# EAGLE design EMG_SENSOR (EAGLE 9.2.2)
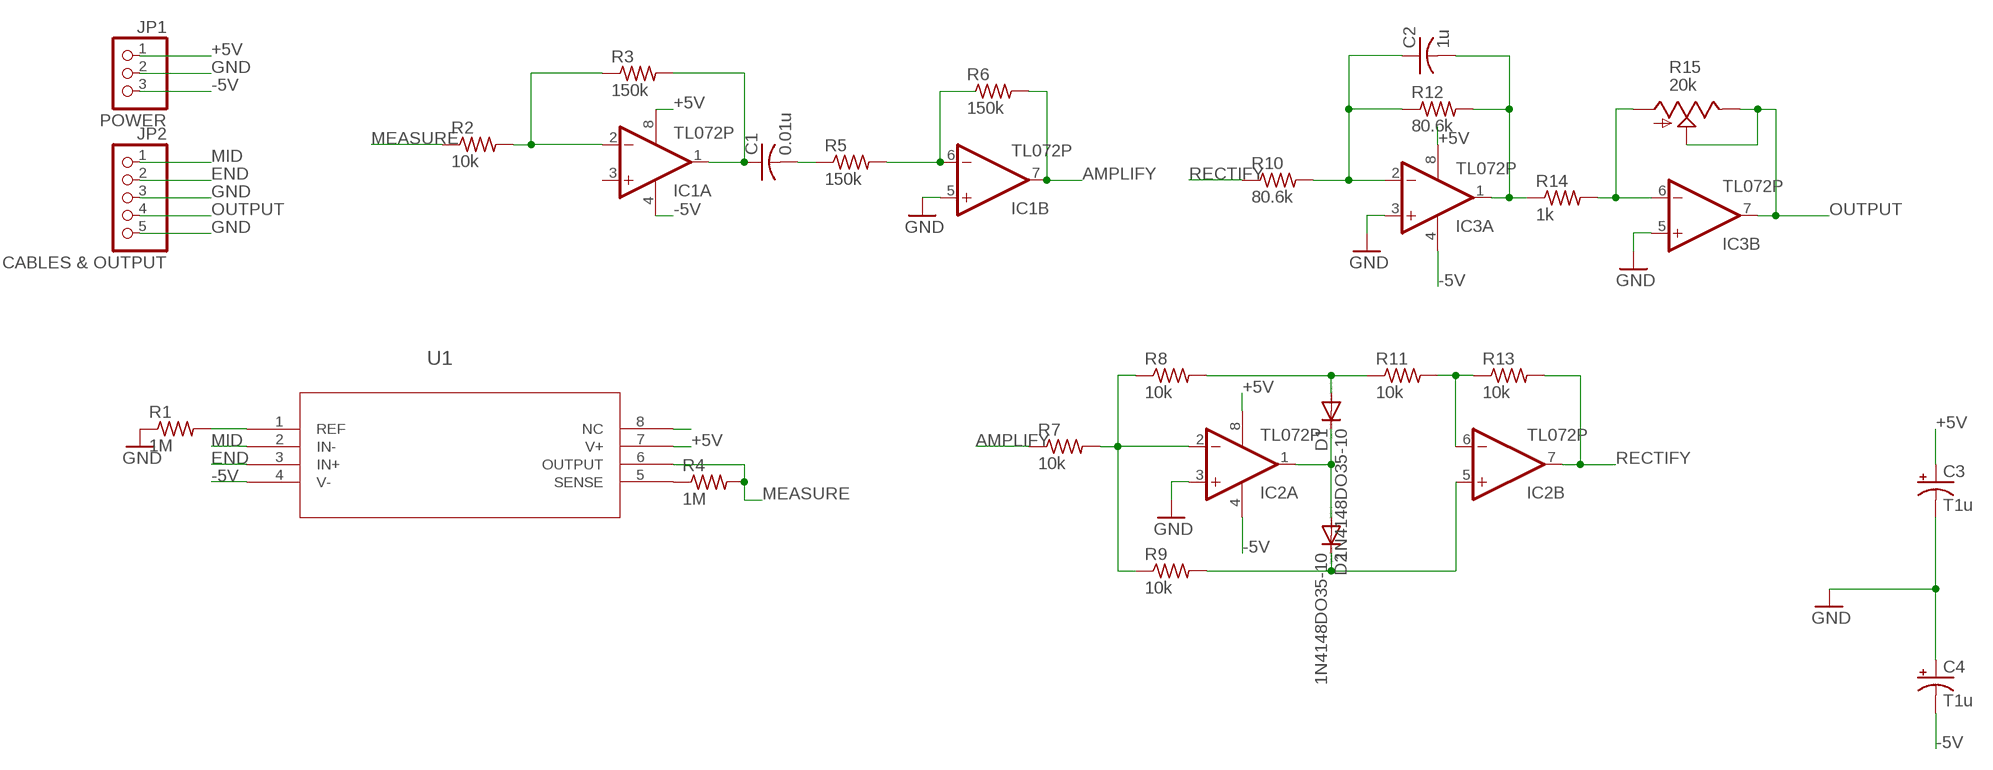
[diagram p0: schematic, sheet 1]

## Parts
C1  0.01u  C-USC1206K  [C1206K]
C2  1u  C-USC1206K  [C1206K]
C3  T1u  CPOL-USE2-4  [E2-4]
C4  T1u  CPOL-USE2-4  [E2-4]
D1  1N4148DO35-10  [DO35-10]
D2  1N4148DO35-10  [DO35-10]
IC1  TL072P  [DIL08]
IC2  TL072P  [DIL08]
IC3  TL072P  [DIL08]
JP1  POWER  PINHD-1X3  [1X03]
JP2  CABLES & OUTPUT  PINHD-1X5  [1X05]
R1  1M  R-US_R1206W  [R1206W]
R2  10k  R-US_R1206W  [R1206W]
R3  150k  R-US_R1206W  [R1206W]
R4  1M  R-US_R1206W  [R1206W]
R5  150k  R-US_R1206W  [R1206W]
R6  150k  R-US_R1206W  [R1206W]
R7  10k  R-US_R1206W  [R1206W]
R8  10k  R-US_R1206W  [R1206W]
R9  10k  R-US_R1206W  [R1206W]
R10  80.6k  R-US_R1206W  [R1206W]
R11  10k  R-US_R1206W  [R1206W]
R12  80.6k  R-US_R1206W  [R1206W]
R13  10k  R-US_R1206W  [R1206W]
R14  1k  R-US_R1206W  [R1206W]
R15  20k  TRIM_US-B25P  [B25P]
U1  INA106_P_8  [P8]

## Nets
+5V: C3.+ IC1.8(P:V+) IC2.8(P:V+) IC3.8(P:V+) JP1.1 U1.7(V+)
-5V: C4.- IC1.4(P:V-) IC2.4(P:V-) IC3.4(P:V-) JP1.3 U1.4(V-)
AMPLIFY: IC1.7(B:OUT) R6.2 R7.1
END: JP2.2 U1.3(IN+)
GND: C3.- C4.+ IC1.5(B:+IN) IC2.3(A:+IN) IC3.3(A:+IN) IC3.5(B:+IN) JP1.2 JP2.3 JP2.5 R1.1
MEASURE: R2.1 R4.2 U1.6(OUTPUT)
MID: JP2.1 U1.2(IN-)
N$1: U1.1(REF)
N$2: IC2.2(A:-IN) R7.2 R9.1
N$3: IC2.6(B:-IN) R11.2 R13.1
N$4: IC1.2(A:-IN) R2.2 R3.1
N$5: U1.8(NC)
N$6: C1.1 IC1.1(A:OUT) R3.2
N$7: C1.2 R5.1
N$8: R4.1 U1.5(SENSE)
N$9: IC1.6(B:-IN) R5.2
N$10: R6.1
N$11: D1.C D2.A IC2.1(A:OUT)
N$12: D1.A R8.2 R11.1
N$13: C2.1 IC3.2(A:-IN) R10.2 R12.1
N$14: D2.C IC2.5(B:+IN) R9.2
N$15: R8.1
N$16: C2.2 IC3.1(A:OUT) R12.2 R14.1
N$17: IC3.6(B:-IN) R14.2 R15.A
OUTPUT: IC3.7(B:OUT) JP2.4 R15.E R15.S
RECTIFY: IC2.7(B:OUT) R10.1 R13.2
Unconnected: IC1.3(A:+IN) R1.2

## Library data of the parts
C1 = rcl:C-US: CAPACITOR, American symbol; OC_NEWARK: unknown
C2 = rcl:C-US: CAPACITOR, American symbol; MPN: MC0805Y104M500A2.54MM; OC_NEWARK: 46P6667
C3 C4 = rcl:CPOL-US: POLARIZED CAPACITOR, American symbol; OC_NEWARK: unknown
D1 D2 = diode:1N4148: DIODE high speed (Philips); OC_NEWARK: unknown
IC1-IC3 = linear:TL072: OP AMP; OC_NEWARK: unknown
JP1 = pinhead:PINHD-1X3: PIN HEADER; OC_NEWARK: unknown
JP2 = pinhead:PINHD-1X5: PIN HEADER; OC_NEWARK: unknown
R1-R14 = resistor:R-US_: RESISTOR, American symbol; OC_NEWARK: unknown
R15 = pot:TRIM_US-: POTENTIOMETER; OC_NEWARK: unknown
U1 = INA160:INA106_P_8; DATASHEETURL: httpwww.ti.comlitgpnINA106; FAMILY_NAME: DIFFERENCE AMPLIFIER; GENERIC_PART_NUMBER: INA106; INDUSTRY_STD_PKG_TYPE: PDIP; MANUFACTURER: Texas Instruments; MANUFACTURER_PART_NUMBER: ina106_p_8; OC_NEWARK: unknown; PACKAGE_DESIGNATOR: P; PIN_COUNT: 8; VENDOR: Texas Instruments

## Board
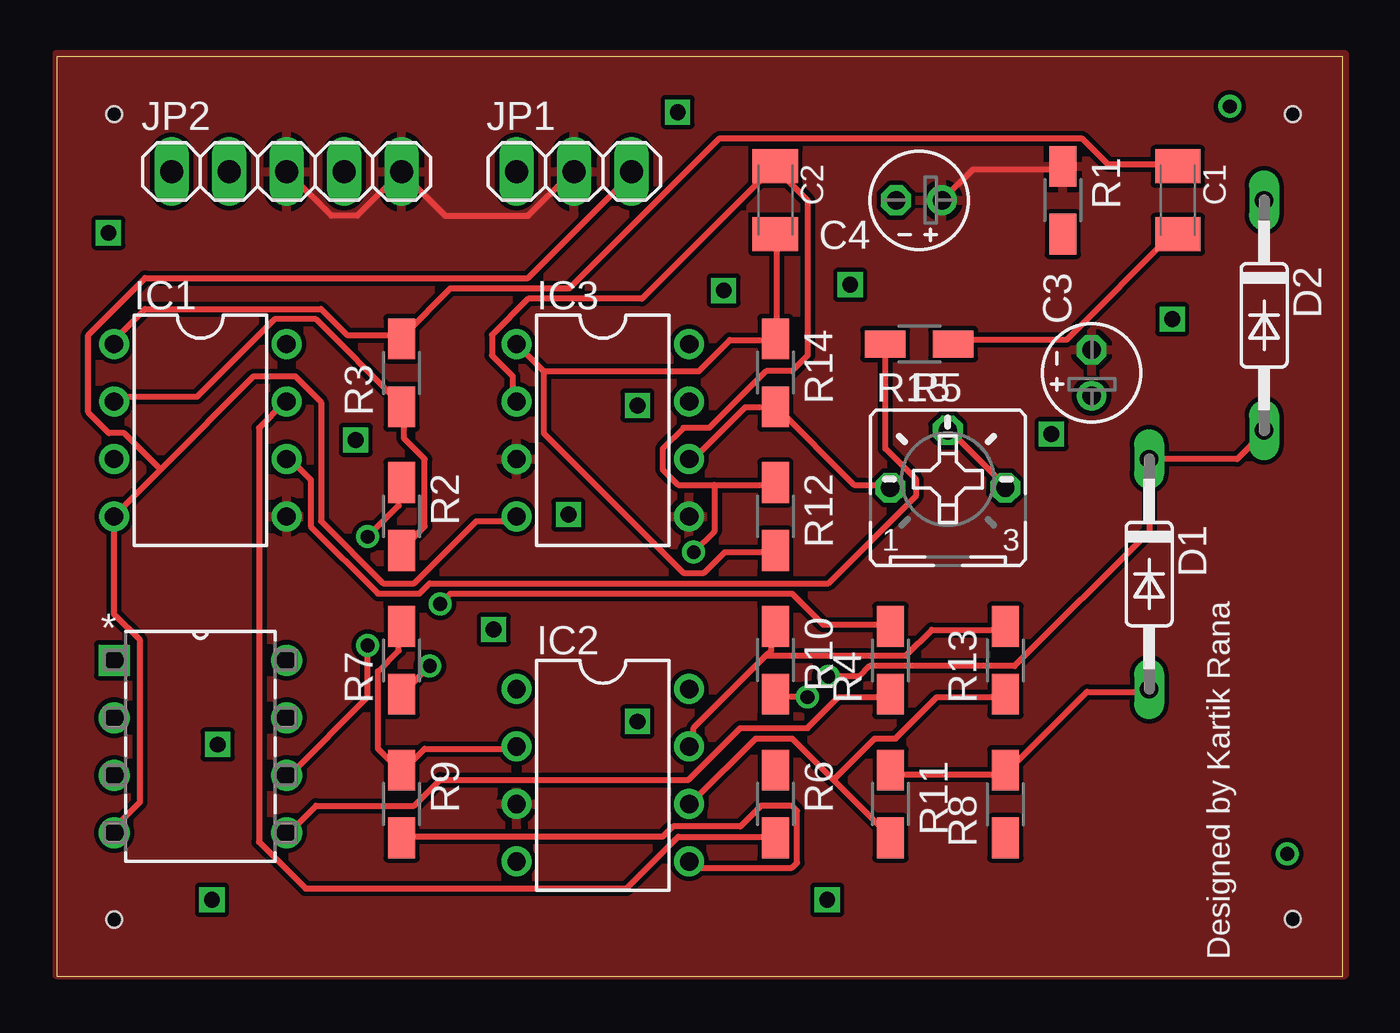
[diagram p1: board, top side]
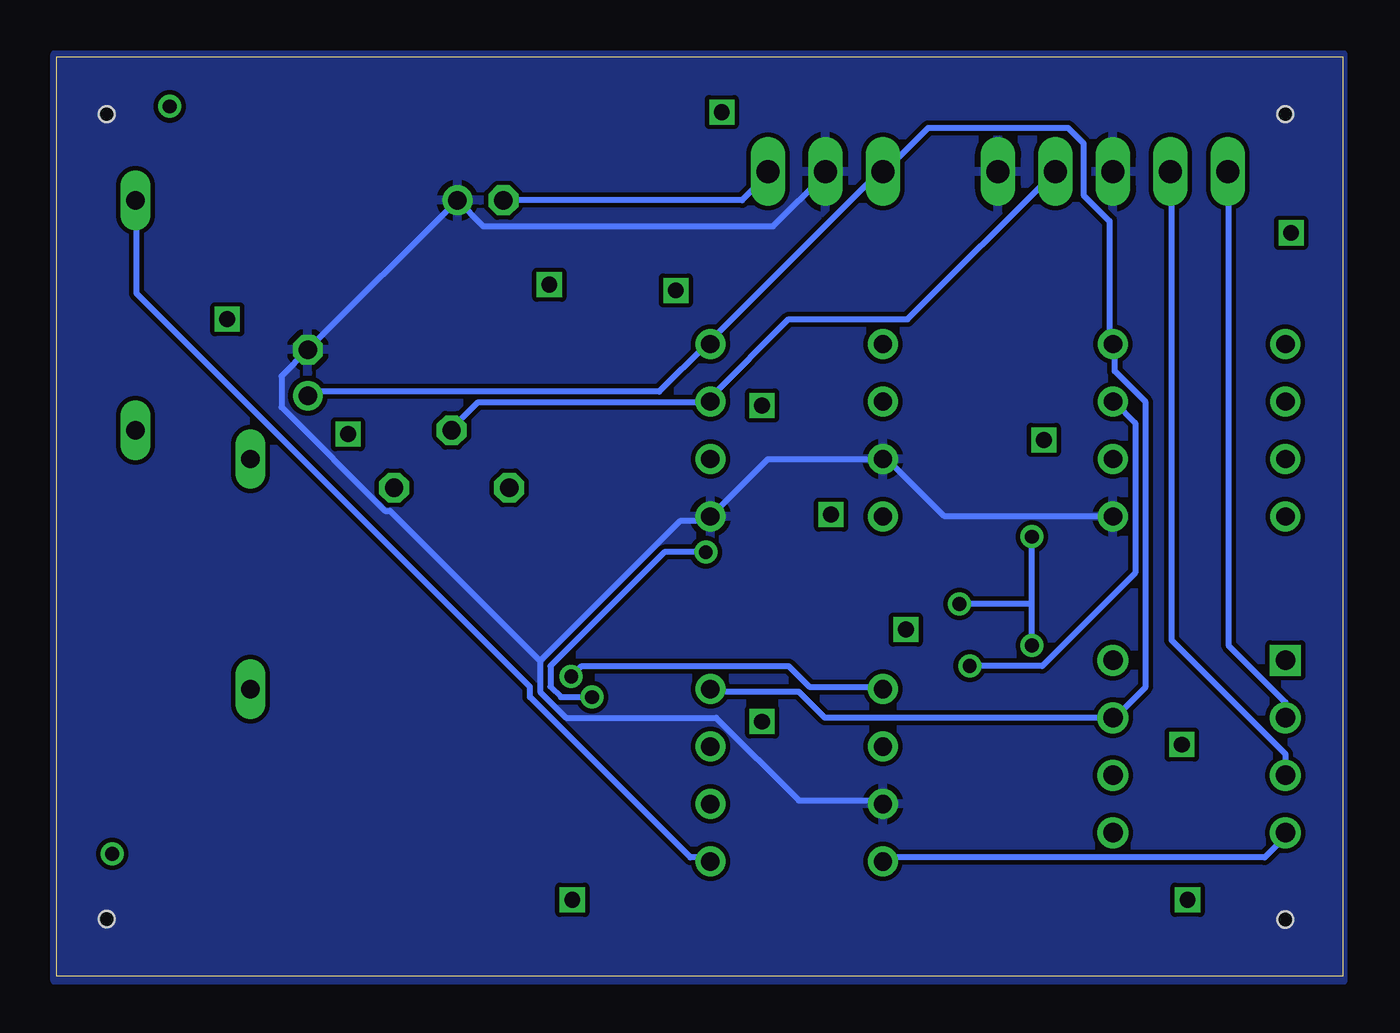
[diagram p2: board, bottom side, seen from below]

Size 56.82 x 40.62 mm. Coordinates in mm from the lower left corner, seen from the top.
Outline: 0,40.62 0,0 56.82,0 56.82,40.62 0,40.62
Copper layers (1*16): Top 0.035mm / dielectric 1.5mm / Bottom 0.035mm
Design rules "default *": minimum track width 10mil, minimum drill 24mil, track to track 8mil, track to pad 8mil, pad to pad 8mil, via to via 8mil, smd to smd 8mil, copper to edge 0mil, drill to drill 8mil, minimum pad ring 10mil, minimum via ring 8mil, stop-mask expansion 4mil, vias tented up to drill 0mil, thermal gap 10mil
Holes 0.7 mm at 54.61,38.08 54.61,2.52 2.54,38.08 2.54,2.49

### Footprints (pad centres in the part's own frame; a part is rotated, then mirrored left to right if it is on the bottom)
C1206K = smd 1.5 x 2: 1 -1.5,0; 2 1.5,0
E2-4 = drill 0.813 pad 1.27: + -1.016,0 | drill 0.813 pad 1.27 octagon: - 1.016,0
DO35-10 = drill 0.813 long: A 5.08,0; C -5.08,0
DIL08 = drill 0.813 pad 1.27: 1 -3.81,-3.81; 2 -1.27,-3.81; 3 1.27,-3.81; 4 3.81,-3.81; 5 3.81,3.81; 6 1.27,3.81; 7 -1.27,3.81; 8 -3.81,3.81
1X03 = drill 1.016 long: 1 -2.54,0; 2 0,0; 3 2.54,0
1X05 = drill 1.016 long: 1 -5.08,0; 2 -2.54,0; 3 0,0; 4 2.54,0; 5 5.08,0
R1206W = smd 1.8 x 1.2: 1 -1.499,0; 2 1.499,0
B25P = drill 0.813 octagon: A -2.54,0; E 2.54,0; S 0,2.54
P8 = drill 0.864 pad 1.372 square: 1 -7.62,7.62 | drill 0.864 pad 1.372: 2 -7.62,5.08; 3 -7.62,2.54; 4 -7.62,0; 5 0,0; 6 0,2.54; 7 0,5.08; 8 0,7.62

### Placement (x,y rotation side)
C1  49.53,34.27 270 top
C2  31.75,34.27 270 top
C3  45.72,26.65 90 top
C4  38.1,34.27 180 top
D1  48.26,17.76 270 top
D2  53.34,29.19 270 top
IC1  6.35,24.11 270 top
IC2  24.13,8.87 270 top
IC3  24.13,24.11 270 top
JP1  22.86,35.54 0 top
JP2  10.16,35.54 0 top
R1  44.45,34.27 270 top
R2  15.24,20.3 270 top
R3  15.24,26.65 90 top
R4  36.83,13.95 90 top
R5  38.1,27.92 180 top
R6  31.75,7.6 270 top
R7  15.24,13.95 90 top
R8  41.91,7.6 90 top
R9  15.24,7.6 270 top
R10  31.75,13.95 270 top
R11  36.83,7.6 270 top
R12  31.75,20.3 270 top
R13  41.91,13.95 90 top
R14  31.75,26.65 270 top
R15  39.37,21.57 0 top
U1  10.16,6.33 0 top

### Tracks (layer width: path | path; a pad name or v marks a point on that pad's centre or on a via)
+5V
  Bottom 0.254: IC2.8 27.91,12.55 24.03,12.55 22.89,11.41 U1.7 10.08,11.41 8.71,12.78 8.71,25.35 10.08,26.73 10.08,27.87 IC1.8 10.31,28.1 10.31,33.36 11.46,34.5 11.46,36.78 12.14,37.47 18.31,37.47 20.14,35.64 JP1.1 20.37,35.64 27.91,28.1 IC3.8 28.14,27.87 30.2,25.81 45.52,25.81 C3.+
-5V
  Top 0.254: 4.6,22.38 2.54,20.33 IC1.4 2.54,15.98 3.68,14.84 3.68,7.68 2.54,6.54 U1.4 | 4.6,22.38 8.71,26.5 10.54,26.5 11.68,25.35 11.68,20.1 14.43,17.35 15.8,17.35 18.54,20.1 20.14,20.1 IC3.4 | 4.6,22.38 3,23.98 2.31,23.98 1.4,24.9 1.4,28.33 3.91,30.84 20.83,30.84 25.4,35.41 JP1.3
  Bottom 0.254: C4.- 26.54,34.27 25.4,35.41 JP1.3 | IC2.4 20.14,5.24 3.45,5.24 2.54,6.15 U1.4
AMPLIFY  (via drill 0.61)
  Top 0.254: v16.48,13.7 15.34,12.55 R7.1 | R6.2 31.57,6.15 27.46,6.15 25.17,3.87 11,3.87 8.94,5.92 8.94,24.21 10.08,25.35 IC1.7
  Bottom 0.254: v16.48,13.7 13.28,13.7 9.17,17.81 9.17,24.44 10.08,25.35 IC1.7
END
  Bottom 0.254: U1.3 2.54,9.81 7.57,14.84 7.57,35.41 JP2.2
GND
  Top 0.254: JP2.3 10.31,35.41 12.14,33.58 13.28,33.58 JP2.5 15.34,35.41 17.17,33.58 20.83,33.58 22.66,35.41 JP1.2 | C4.+ 40.49,35.64 44.37,35.64 R1.1
  Bottom 0.254: IC1.5 10.31,20.33 17.63,20.33 20.14,22.84 IC3.3 25.4,22.84 IC3.5 28.14,20.1 29.29,20.1 35.46,13.92 | 35.46,13.92 35.46,12.55 34.32,11.41 27.69,11.41 24.03,7.75 20.37,7.75 IC2.3 | JP1.2 22.89,35.41 25.17,33.13 37.97,33.13 C4.+ C3.- 46.89,26.5 46.89,25.13 42.32,20.55 42.09,20.55 35.46,13.92
  pour Top (isolate 0.004): 0,40.7 0,0.06 56.9,0.06 56.9,40.7
  pour Bottom (isolate 0.004): 0,40.45 0,-0.19 56.9,-0.19 56.9,40.7 0,40.7
MEASURE  (via drill 0.61)
  Top 0.254: v13.74,19.41 15.11,20.78 15.11,21.7 R2.1 | v13.74,14.61 13.74,12.32 10.31,8.9 U1.6 | v16.94,16.44 17.4,16.9 32.49,16.9 33.86,15.52 36.83,15.52 R4.2
  Bottom 0.254: v13.74,14.61 13.74,16.44 | 13.74,16.44 v13.74,19.41 | 13.74,16.44 v16.94,16.44
MID
  Bottom 0.254: U1.2 2.54,12.1 5.05,14.61 5.05,35.41 JP2.1
N$2
  Top 0.254: R7.2 15.11,15.3 15.11,14.38 14.2,13.47 14.2,10.04 15.11,9.12 R9.1 15.34,9.12 16.26,10.04 20.14,10.04 IC2.2
N$3
  Top 0.254: 34.32,8.67 32.49,10.5 30.89,10.5 28.14,7.75 IC2.6 | 34.32,8.67 36.83,6.15 R11.2 | 34.32,8.67 36.14,10.5 37.06,10.5 38.89,12.32 41.86,12.32 R13.1
N$4
  Top 0.254: R2.2 15.34,18.95 16.26,19.87 16.26,22.84 15.34,23.75 15.34,25.13 R3.1 15.11,25.35 11.46,29.01 9.63,29.01 6.2,25.58 2.54,25.58 IC1.2
N$6
  Top 0.254: IC1.1 2.54,28.1 3.91,29.47 11.68,29.47 12.83,28.33 15.11,28.33 R3.2 15.34,28.33 17.4,30.38 22.66,30.38 29.29,37.01 45.29,37.01 46.43,35.87 49.4,35.87 C1.1
N$7
  Top 0.254: R5.1 39.8,28.1 44.6,28.1 49.4,32.9 C1.2
N$8
  Top 0.254: R4.1 36.83,12.32 34.54,12.32 33.17,10.95 30.2,10.95 27.91,8.67 16.94,8.67 15.8,7.52 11.46,7.52 10.31,6.38 U1.5
N$9
  Top 0.254: R5.2 36.6,27.87 36.6,23.3 37.97,21.93 37.97,21.24 34.09,17.35 16.48,17.35 16.03,16.9 14.2,16.9 11.23,19.87 11.23,21.93 10.31,22.84 IC1.6
N$11  (via drill 0.61)
  Top 0.254: D2.A 53.29,23.98 52.15,22.84 D1.C 48.26,19.64 42.32,13.7 35.92,13.7 35.46,13.24 v34.09,13.24
  Bottom 0.254: v34.09,13.24 33.63,13.7 24.49,13.7 23.57,12.78 20.37,12.78 IC2.1
N$12
  Top 0.254: R11.1 36.83,8.9 41.86,8.9 R8.2 42.09,9.12 45.52,12.55 48.26,12.55 D1.A
N$13  (via drill 0.61)
  Top 0.254: 29.06,21.7 27.46,21.7 26.77,22.38 26.77,23.3 27.69,24.21 28.83,24.21 31.34,26.73 32.49,26.73 33.17,27.41 33.17,34.27 31.8,35.64 C2.1 31.57,35.64 25.86,29.93 20.83,29.93 19.23,28.33 19.23,27.41 20.14,26.5 20.14,25.58 IC3.2 | 29.06,21.7 31.57,21.7 R12.1 | v33.17,12.32 31.8,12.32 R10.2 | v28.14,18.72 29.06,19.64 29.06,21.7
  Bottom 0.254: v33.17,12.32 34.54,12.32 35,12.78 35,13.7 29.97,18.72 v28.14,18.72
N$14
  Top 0.254: R9.2 15.34,6.15 26.77,6.15 27.23,6.61 30.2,6.61 31.12,7.52 32.49,7.52 32.72,7.29 32.72,5.01 32.49,4.78 28.37,4.78 28.14,5.01 IC2.5
  Bottom 0.254: D2.C 53.29,34.27 53.29,30.15 35.92,12.78 35.92,12.32 28.83,5.24 28.14,5.24 IC2.5
N$16
  Top 0.254: C2.2 31.8,32.67 31.8,28.33 R14.1 31.57,28.1 29.74,28.1 28.37,26.73 21.51,26.73 | 21.51,26.73 21.51,23.98 27.69,17.81 28.6,17.81 29.51,18.72 31.57,18.72 R12.2 | IC3.1 21.51,26.73
N$17
  Top 0.254: IC3.6 28.14,22.84 30.43,25.13 31.57,25.13 R14.2 31.8,25.13 35.23,21.7 36.83,21.7 R15.A
N$18  (via drill 0.7 pad 0.25)
  other vias: 35.06,30.54
N$19  (via drill 0.7 pad 0.25)
  other vias: 29.47,30.29
N$20  (via drill 0.7 pad 0.25)
  other vias: 43.95,23.94
N$22  (via drill 0.7 pad 0.25)
  other vias: 34.04,3.37
N$23  (via drill 0.7 pad 0.25)
  other vias: 6.86,3.37
N$24  (via drill 0.7 pad 0.25)
  other vias: 7.12,10.22
N$25  (via drill 0.7 pad 0.25)
  other vias: 27.44,38.16
N$26  (via drill 0.7 pad 0.25)
  other vias: 2.29,32.83
N$27  (via drill 0.7 pad 0.25)
  other vias: 22.61,20.38
N$28  (via drill 0.7 pad 0.25)
  other vias: 25.66,11.24
N$29  (via drill 0.7 pad 0.25)
  other vias: 19.31,15.3
N$30  (via drill 0.7 pad 0.25)
  other vias: 13.21,23.69
N$31  (via drill 0.7 pad 0.25)
  other vias: 49.28,29.02
N$32  (via drill 0.7 pad 0.25)
  other vias: 25.66,25.21
N$35  (via drill 0.61)
  other vias: 51.82,38.42
N$36  (via drill 0.61)
  other vias: 54.36,5.4
OUTPUT
  Top 0.254: R15.E 41.86,21.7 39.57,23.98 R15.S
  Bottom 0.254: R15.S 39.34,24.21 38.2,25.35 28.14,25.35 IC3.7 27.91,25.58 24.49,29.01 19.23,29.01 JP2.4
RECTIFY
  Top 0.254: 31.34,14.15 28.14,10.95 28.14,10.27 IC2.7 | 31.34,14.15 31.57,14.38 31.57,15.3 R10.1 | 31.34,14.15 37.52,14.15 38.66,15.3 41.86,15.3 R13.2

### Text on the board
tPlace: Designed by Kartik Rana